# Altium schematic sheet STLINK_2.1.SchDoc: MISKO 3.0
size A4; Date: 19.9.2021; Author: AMADEJ PAPEŽ; SheetNumber: 5; SheetTotal: 13; SheetTitle: STLINK_2.1; Version: V1.1
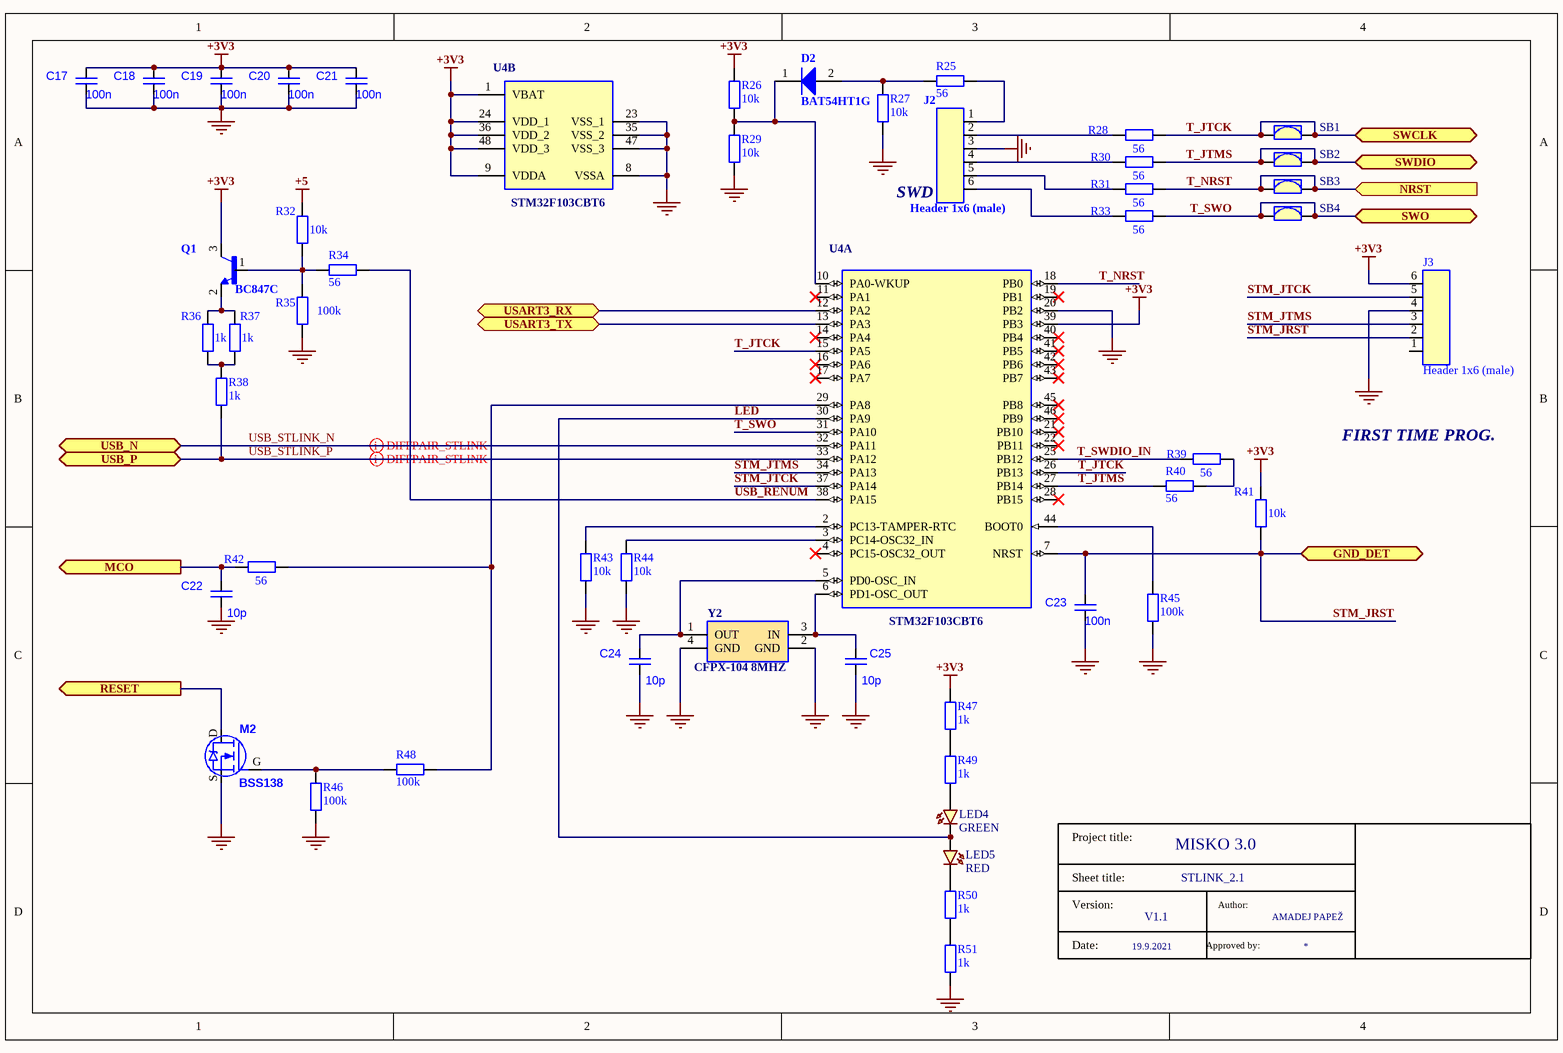
[diagram p0: STLINK_2.1.SchDoc]

## Parts
C17  value 100n  [C0603]
C18  value 100n  [C0603]
C19  value 100n  [C0603]
C20  value 100n  [C0603]
C21  value 100n  [C0603]
C22  value 10p  [C0603]
C23  value 100n  [C0603]
C24  value 10p  [C0603]
C25  value 10p  [C0603]
D2  BAT54HT1G  [ONSC-SOD-323-2-477-02_V]
J2  Header 1x6 (male)  [H1x6]
J3  Header 1x6 (male)  [H1x6_no3D]
LED4  GREEN  [LED0603]
LED5  RED  [LED0603]
M2  BSS138  [SOT23-3_L]
Q1  BC847C  [SOT23-3_L]
R25  value 56  [R1608_0603I_L]
R26  value 10k  [R1608_0603I_L]
R27  value 10k  [R1608_0603I_L]
R28  value 56  [R1608_0603I_L]
R29  value 10k  [R1608_0603I_L]
R30  value 56  [R1608_0603I_L]
R31  value 56  [R1608_0603I_L]
R32  value 10k  [R1608_0603I_L]
R33  value 56  [R1608_0603I_L]
R34  value 56  [R1608_0603I_L]
R35  value 100k  [R1608_0603I_L]
R36  value 1k  [R1608_0603I_L]
R37  value 1k  [R1608_0603I_L]
R38  value 1k  [R1608_0603I_L]
R39  value 56  [R1608_0603I_L]
R40  value 56  [R1608_0603I_L]
R41  value 10k  [R1608_0603I_L]
R42  value 56  [R1608_0603I_L]
R43  value 10k  [R1608_0603I_L]
R44  value 10k  [R1608_0603I_L]
R45  value 100k  [R1608_0603I_L]
R46  value 100k  [R1608_0603I_L]
R47  value 1k  [R1608_0603I_L]
R48  value 100k  [R1608_0603I_L]
R49  value 1k  [R1608_0603I_L]
R50  value 1k  [R1608_0603I_L]
R51  value 1k  [R1608_0603I_L]
SB1  SD_JUMP  [SOLDER_JUMPER]  (value not drawn)
SB2  SD_JUMP  [SOLDER_JUMPER]  (value not drawn)
SB3  SD_JUMP  [SOLDER_JUMPER]  (value not drawn)
SB4  SD_JUMP  [SOLDER_JUMPER]  (value not drawn)
T5  (no value)
U4  STM32F103CBT6  [STM-LQFP48_L]  (parts A,B of 2)
Y2  CFPX-104 8MHZ  [ABM3B8MHZB2T]

## Ports
GND_DET (bidir), MCO (out), NRST (in), RESET (out), SWCLK (bidir), SWDIO (bidir), SWO (bidir), USART3_RX (bidir), USART3_TX (bidir), USB_N (bidir), USB_P (bidir)

## Nets
+3V3: C17.2 C18.2 C19.2 C20.2 C21.2 J3.6 Q1.3(C) R26.1 R41.1 R47.2 U4.1(VBAT) U4.9(VDDA) U4.24(VDD_1) U4.36(VDD_2) U4.39(PB3) U4.48(VDD_3)
+5: R32.1
GND: C17.1 C18.1 C19.1 C20.1 C21.1 C22.1 C23.1 C24.1 C25.1 J2.3 J3.4 M2.S R27.1 R29.1 R35.2 R43.2 R44.2 R45.1 R46.2 R51.2 U4.8(VSSA) U4.20(PB2) U4.23(VSS_1) U4.35(VSS_2) U4.47(VSS_3) Y2.2(GND) Y2.4(GND)
LED: LED4.1(KATODE) LED5.2(ANODE) U4.30(PA9)
MCO: C22.2 R42.1 ; port MCO
RESET: M2.D ; port RESET
STM_JRST: C23.2 J3.2 R41.2 U4.7(NRST) ; port GND_DET
STM_JTCK: J3.5 U4.37(PA14)
STM_JTMS: J3.3 U4.34(PA13)
T_JTCK: R28.2 SB1.1 SB1.2 U4.15(PA5) U4.26(PB13) ; port SWCLK
T_JTMS: R30.2 R40.2 SB2.1 SB2.2 U4.27(PB14) ; port SWDIO
T_NRST: R31.2 SB3.1 SB3.2 U4.18(PB0) ; port NRST
T_SWDIO_IN: R39.1 U4.25(PB12)
T_SWO: R33.2 SB4.1 SB4.2 U4.31(PA10) ; port SWO
USART3_RX: U4.12(PA2) ; port USART3_RX
USART3_TX: U4.13(PA3) ; port USART3_TX
USB_RENUM: R34.2 U4.38(PA15)
USB_STLINK_N: U4.32(PA11) ; port USB_N
USB_STLINK_P: R38.1 U4.33(PA12) ; port USB_P
NetC24_2: C24.2 U4.5(PD0-OSC_IN) Y2.1(OUT)
NetC25_2: C25.2 U4.6(PD1-OSC_OUT) Y2.3(IN)
NetD2_1: D2.1(K) R26.2 R29.2 U4.10(PA0-WKUP)
NetD2_2: D2.2(A) R25.2 R27.2
NetJ2_1: J2.1 R25.1
NetJ2_2: J2.2 R28.1
NetJ2_4: J2.4 R30.1
NetJ2_5: J2.5 R31.1
NetJ2_6: J2.6 R33.1
NetLED4_2: LED4.2(ANODE) R49.1
NetLED5_1: LED5.1(KATODE) R50.1
NetM2_G: M2.G R46.1 R48.2
NetQ1_1: Q1.1(B) R32.2 R34.1 R35.1
NetQ1_2: Q1.2(E) R36.2 R37.2
NetR36_1: R36.1 R37.1 R38.2
NetR39_2: R39.2 R40.1
NetR42_2: R42.2 R48.1 U4.29(PA8)
NetR43_1: R43.1 U4.2(PC13-TAMPER-RTC)
NetR44_1: R44.1 U4.3(PC14-OSC32_IN)
NetR45_2: R45.2 U4.44(BOOT0)
NetR47_1: R47.1 R49.2
NetR50_2: R50.2 R51.1

Not connected (* = marked no-connect by the designer): J3 1; U4 4(PC15-OSC32_OUT)* 11(PA1)* 14(PA4)* 16(PA6)* 17(PA7)* 19(PB1)* 21(PB10)* 22(PB11)* 28(PB15)* 40(PB4)* 41(PB5)* 42(PB6)* 43(PB7)* 45(PB8)* 46(PB9)*

## Layout directives
differential pair: USB_STLINK_N, USB_STLINK_P

## Notes on the sheet
- SWD
- FIRST TIME PROG.
- (in symbol Title block) Project title:; Sheet title:; Version:; Author:; Date:; Approved by:

## Library data of the parts
C17-C21 C23 = C: Capacitor; Code: NB6-100N
C22 C24 C25 = C: Capacitor; Code: NB2-10P
D2 = BAT54HT1G: Schottky Barrier Diode, 2-Pin SOD-323, Pb-Free, Tape and Reel; Manufacturer: ON Semiconductor / Fairchild; Configuration: Single; trr Max (ns): 5; IFSM Max (A): 0.6; Code: KDBAT54H; ComponentLink3URL: http://www.onsemi.com/pub_link/Collateral/477-02.PDF.1; PackageDescription: 2-Pin SOD, Body 1.7 x 1.25 mm; ComponentLink2URL: http://www.onsemi.cn/pub_link/Collateral/BAT54HT1-D.PDF; ComponentLink3Description: Package Specification; ComponentLink2Description: Datasheet; DatasheetVersion: Rev. 6; PackageReference: SOD-323-2-477-02; RoHS: TRUE; ComponentLink1URL: http://www.onsemi.com/; Packing: Tape and Reel; PartNumber: BAT54HT1G; Mounting Technology: Surface Mount; ComponentLink1Description: Manufacturer URL; PackageVersion: Rev. H, 03/2007; Manufacturer Part Number: BAT54HT1G
J2 J3 = H1x6
LED4 = LED: Green light-emitting diode; Code: KLC-G
LED5 = LED: Red light-emitting diode; Code: KLC-R
M2 = BSH103: BSH103-T/R (NMOS); pin to pad: D>3 G>1 S>2; Code: BSH103-T/R
Q1 = BC847C: Bipolar (BJT) Transistor NPN 45V 100mA 100MHz 250mW Surface Mount TO-236AB; MF: Nexperia USA; Code: KT-NPN-S; MP: BC847C; Package: SOT-23 Nexperia USA; Availability: Unavailable; Price: None; Arrow_Electronics-Purchase-URL: https://snapeda.com/shop?store=Arrow+Electronics&id=590780; SnapEDA_Link: https://www.snapeda.com/parts/BC847C/Nexperia%20USA%20Inc./view-part/590780/?ref=snap; Value: *; KT-NPN-S: *
R25 R28 R30 R31 R33 R34 R39 R40 R42 = R: Code: LC2-56E
R26 R27 R29 R32 R41 R43 R44 = R: Code: LC5-10K
R35 R45 R46 R48 = R: Code: LC6-100K
R36-R38 R47 R49-R51 = R: Code: LC4-1K
T5 = Title block
U4 = STM32F103CBT6: ARM Cortex-M3 32-bit MCU, 128 KB Flash, 20 KB Internal RAM, 37 I/Os, 48-pin LQFP, -40 to 85 degC, Tray / DataSheet: / https://www.st.com/resource/en/datasheet/stm32f103c8.pdf / About STLINK: / https://www.st.com/resource/en/user_manual/dm00231744-stm32-nucleo-32-boards-mb1180-stmicroelectronics.pdf; Supply Voltage(Vcc) min (V): 2; Operating Frequency(F) (Processor speed) (MHz): 72; A/D Converter: 2x12-bit (10 Channel); FLASH Size (Prog) (kB): 128; Internal RAM Size (kB): 20; I/Os (High Current): 37; Code: BSTM32F103CBT6; ComponentLink2Description: Datasheet; PackageReference: LQFP48; PartNumber: STM32F103CBT6; ComponentLink1Description: Manufacturer URL; DatasheetVersion: Rev. 16; PackageVersion: Rev. 6, 06/2013; Packing: Tray; ComponentLink1URL: http://www.st.com/web/en/home.html; Mounting Technology: Surface Mount; ComponentLink3URL: http://www.st.com/st-web-ui/static/active/en/resource/technical/document/datasheet/DM00058181.pdf; PackageDescription: 48-Pin Low Profile Quad Flat Package, 7 x 7 mm Body, 0.5 mm Pitch; Core: ARM Cortex-M3; ComponentLink3Description: Package Specification; ComponentLink2URL: http://www.st.com/st-web-ui/static/active/en/resource/technical/document/datasheet/CD00161566.pdf; Manufacturer: STMicroelectronics; Manufacturer Part Number: STM32F103CBT6
Y2 = ABM3B-8MHZ-B-2-T: Manufacturer_Name: Würth elektronik; Manufacturer_Part_Number: 830055901; Datasheet Link: https://www.we-online.com/catalog/datasheet/830055901.pdf; Height: 1.1mm; Supplier 1: Würth elektronik; Supplier part number 1: 830055901